# EAGLE design tda2003 (EAGLE 5.12)
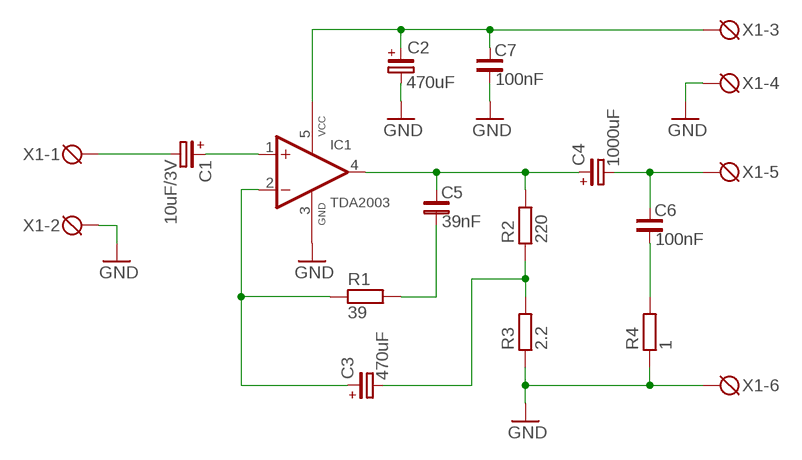
[diagram p0: schematic, sheet 1]

## Parts
C1  10uF/3V  CP_E-020X050  [CE-020X050]
C2  470uF  CP_E-050X100  [CE-050X100]
C3  470uF  CP_E-050X100  [CE-050X100]
C4  1000uF  CP_E-050X100  [CE-050X100]
C5  39nF  C_1206  [C1206]
C6  100nF  C_1206  [C1206]
C7  100nF  C_1206  [C1206]
IC1  TDA2003  [PENTAWATT-V]
R1  39  R_1206  [R1206]
R2  220  R_1206  [R1206]
R3  2.2  R_1206  [R1206]
R4  1  R_1206  [R1206]
X1  DG3XX-06-5.0  [DG306-5.0-06P]

## Nets
GND: C2.- C7.2 IC1.3(GND) R3.1 R4.1 X1.2 X1.4 X1.6
N$1: C5.2 R1.2
N$2: C4.+ C5.1 IC1.4(OUT) R2.2
N$3: C3.- R2.1 R3.2
N$4: C6.2 R4.2
N$5: C4.- C6.1 X1.5
N$6: C2.+ C7.1 IC1.5(VCC) X1.3
N$7: C3.+ IC1.2(-IN) R1.1
N$9: C1.+ IC1.1(+IN)
N$10: C1.- X1.1

## Library data of the parts
C1-C4 = rc-master:CP_: POLARIZED CAP
C5-C7 = rc-master:C_: NON-POLARIZED CAP
IC1 = tda2003:TDA2003: Car Radio Audio Amplifier
R1-R4 = rc-master:R_: RESISTOR
X1 = degson:DG3XX-06: DG350-3.5-06P DG306-5.0-06P

## Board
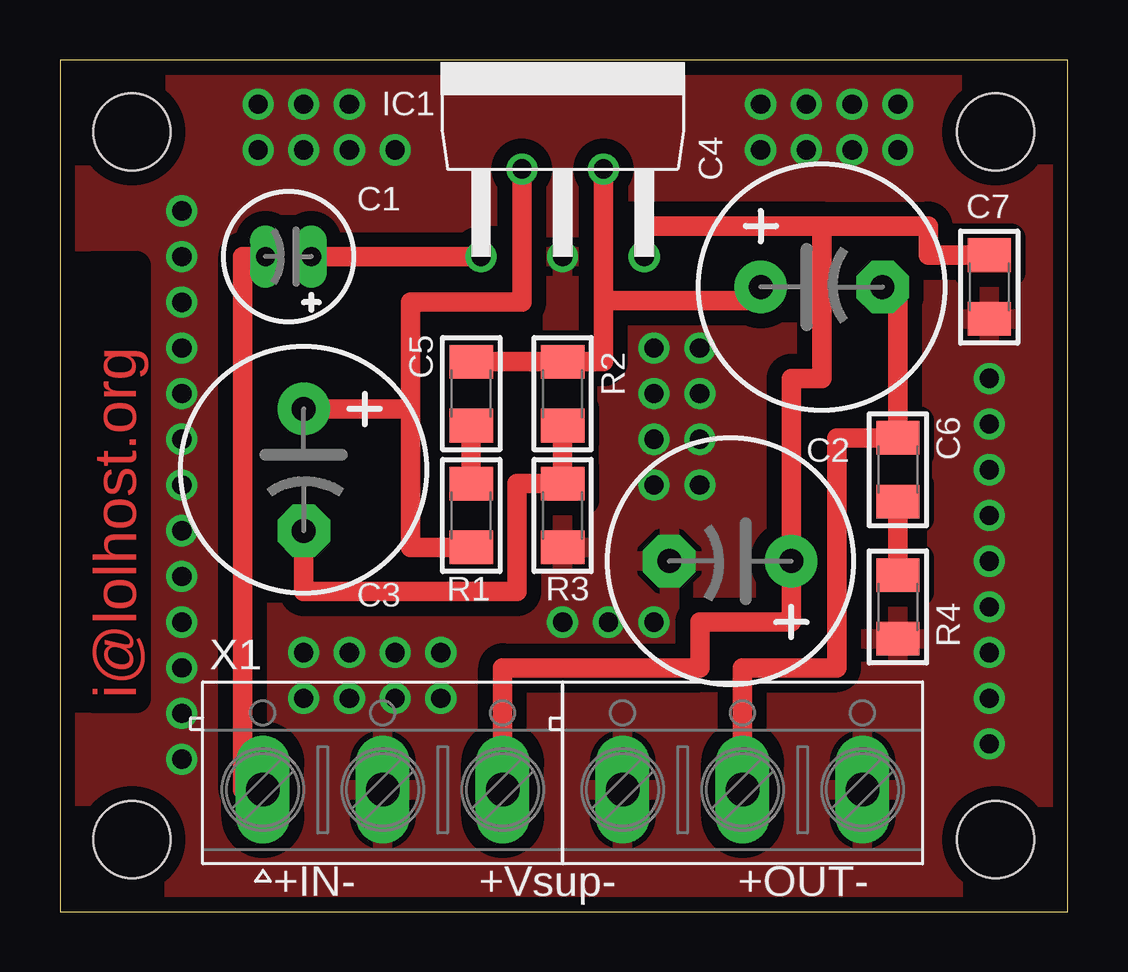
[diagram p1: board, top side]
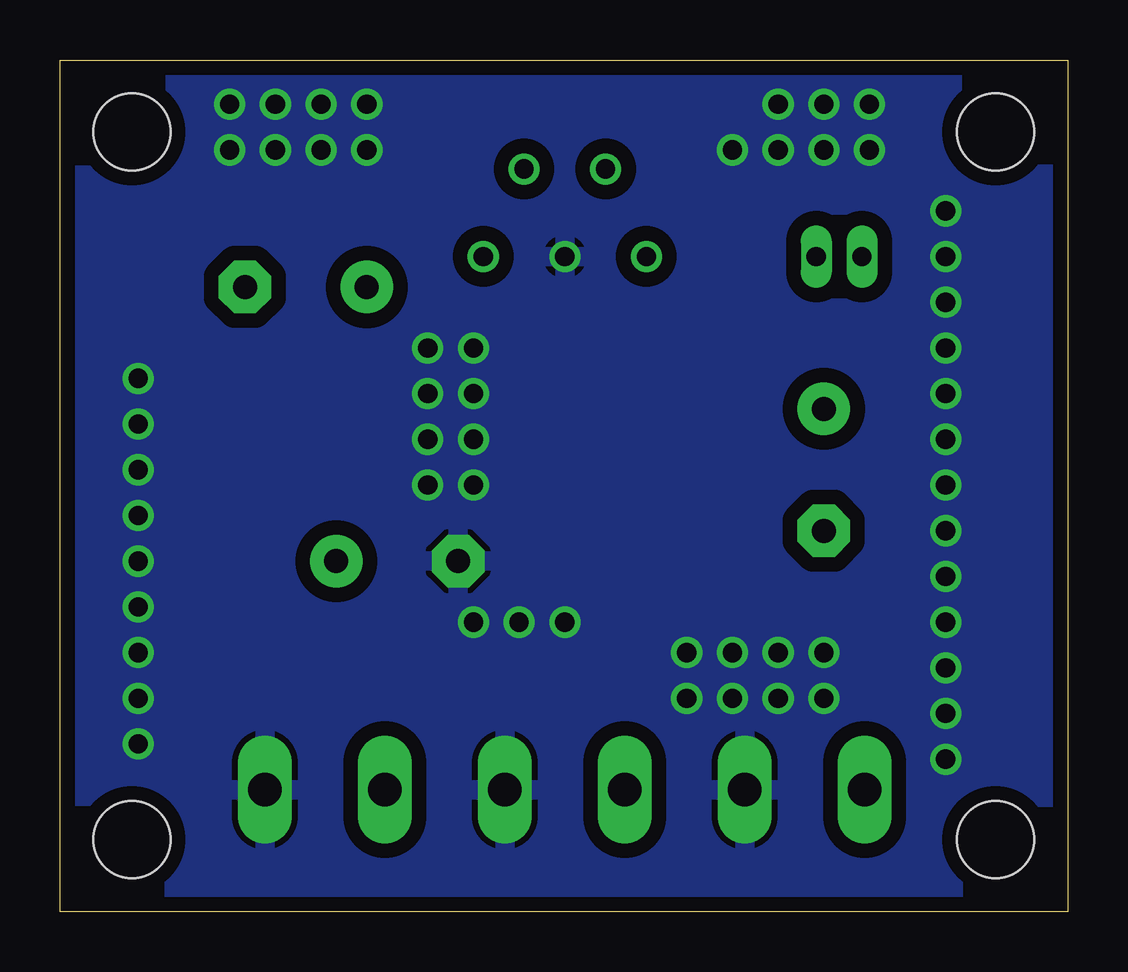
[diagram p2: board, bottom side, seen from below]

Size 42 x 35.5 mm. Coordinates in mm from the lower left corner, seen from the top.
Outline: 0,0 42,0 42,35.5 0,35.5 0,0
Copper layers (1*16): Top 0.018mm / dielectric 1.5011mm / Bottom 0.018mm
Design rules "resonit-speed-18mkm": minimum track width 0.2mm, minimum drill 0.5mm, track to track 0.2mm, track to pad 0.2mm, pad to pad 0.2mm, via to via 0.2mm, smd to smd 0.2mm, copper to edge 0.5mm, drill to drill 8mil, minimum pad ring 0.2489mm, minimum via ring 0.2489mm, stop-mask expansion 4mil, vias tented up to drill 0.5994mm, thermal gap 10mil
Holes 3.2 mm at 3,3 3,32.5 39,3 39,32.5

### Footprints (pad centres in the part's own frame; a part is rotated, then mirrored left to right if it is on the bottom)
CE-020X050 = drill 0.8 long: + -0.953,0; - 0.953,0
CE-050X100 = drill 1 pad 2.184 round: + -2.54,0 | drill 1 pad 2.184 octagon: - 2.54,0
C1206 = smd 1.4 x 1.8: 1 -1.329,0; 2 1.329,0
PENTAWATT-V = drill 0.8 round: 1 -3.4,-3.81; 2 -1.7,-0.16; 3 0,-3.81; 4 1.7,-0.16; 5 3.4,-3.81
R1206 = smd 1.4 x 1.8: 1 -1.329,0; 2 1.329,0
DG306-5.0-06P = drill 1.4 long: 1 -12.5,0; 2 -7.5,0; 3 -2.5,0; 4 2.5,0; 5 7.5,0; 6 12.5,0

### Placement (x,y rotation side)
C1  9.53,27.3 180 top
C2  27.94,14.61 180 top
C3  10.16,18.41 270 top
C4  31.75,26.04 0 top
C5  17.14,21.59 270 top
C6  34.92,18.41 270 top
C7  38.73,26.04 270 top
IC1  20.95,31.11 0 top
R1  17.14,16.51 90 top
R2  20.95,21.59 90 top
R3  20.95,16.51 90 top
R4  34.92,12.7 90 top
X1  20.95,5.08 0 top

### Tracks (layer width: path | path; a pad name or v marks a point on that pad's centre or on a via)
GND  (via drill 0.8)
  other vias: 38.73,14.61 15.88,10.79 38.73,12.7 10.16,31.75 13.97,31.75 24.77,23.5 38.73,10.79 12.06,31.75 38.73,16.51 8.26,31.75 13.97,10.79 12.06,10.79 10.16,10.79 24.77,21.59 26.67,23.5 26.67,21.59 29.21,31.75 31.11,31.75 33.02,31.75 34.92,31.75 38.73,18.41 38.73,20.32 38.73,22.23 5.08,12.06 5.08,13.97 5.08,15.88 5.08,17.78 5.08,19.68 5.08,21.59 5.08,23.5 5.08,25.4 5.08,27.3 5.08,29.21 5.08,10.16 5.08,8.26 5.08,6.35 26.67,19.68 26.67,17.78 24.77,17.78 24.77,19.68 15.88,8.89 13.97,8.89 12.06,8.89 10.16,8.89 29.21,33.66 31.11,33.66 33.02,33.66 34.92,33.66 12.06,33.66 10.16,33.66 8.26,33.66 38.73,8.89 38.73,6.99 20.95,12.06 22.86,12.06 24.77,12.06
  pour Top (isolate 0.61): -1.27,36.83 43.81,36.83 43.81,-1.27 -1.27,-1.27
  pour Bottom (isolate 0.61): -0.64,36.2 42.55,36.2 42.55,-0.64 -0.64,-0.64
N$1
  Top 0.813: R1.2 C5.2
N$2
  Top 0.813: C4.+ 29.21,25.46 22.66,25.46 | 22.66,25.46 IC1.4 | 22.66,25.46 22.66,22.92 R2.2 | R2.2 | C5.1 R2.2
N$3
  Top 0.813: R2.1 R3.2 19.05,17.84 19.05,13.34 10.16,13.34 C3.-
N$4
  Top 0.813: R4.2 C6.2
N$5
  Top 0.813: X1.5 28.45,10.16 32.38,10.16 32.38,19.74 C6.1 34.92,26.04 C4.-
N$6
  Top 0.813: IC1.5 24.36,28.57 31.75,28.57 | C2.+ 30.48,16.45 | 31.75,28.57 31.75,22.23 30.48,22.23 C2.+ | X1.3 18.45,10.16 26.67,10.16 26.67,12.06 30.48,12.06 C2.+ | C7.1 36.2,27.36 36.2,28.57 31.75,28.57
N$7
  Top 0.813: R1.1 14.61,15.18 14.61,20.95 | IC1.2 19.25,25.4 14.61,25.4 14.61,20.95 | 14.61,20.95 C3.+
N$9
  Top 0.813: C1.+ IC1.1
N$10
  Top 0.813: X1.1 7.62,5.08 7.62,27.3 C1.-

### Text on the board
Top: i@lolhost.org
tPlace: +IN- | +Vsup- | +OUT-